# EAGLE design template1 (EAGLE 4.16)
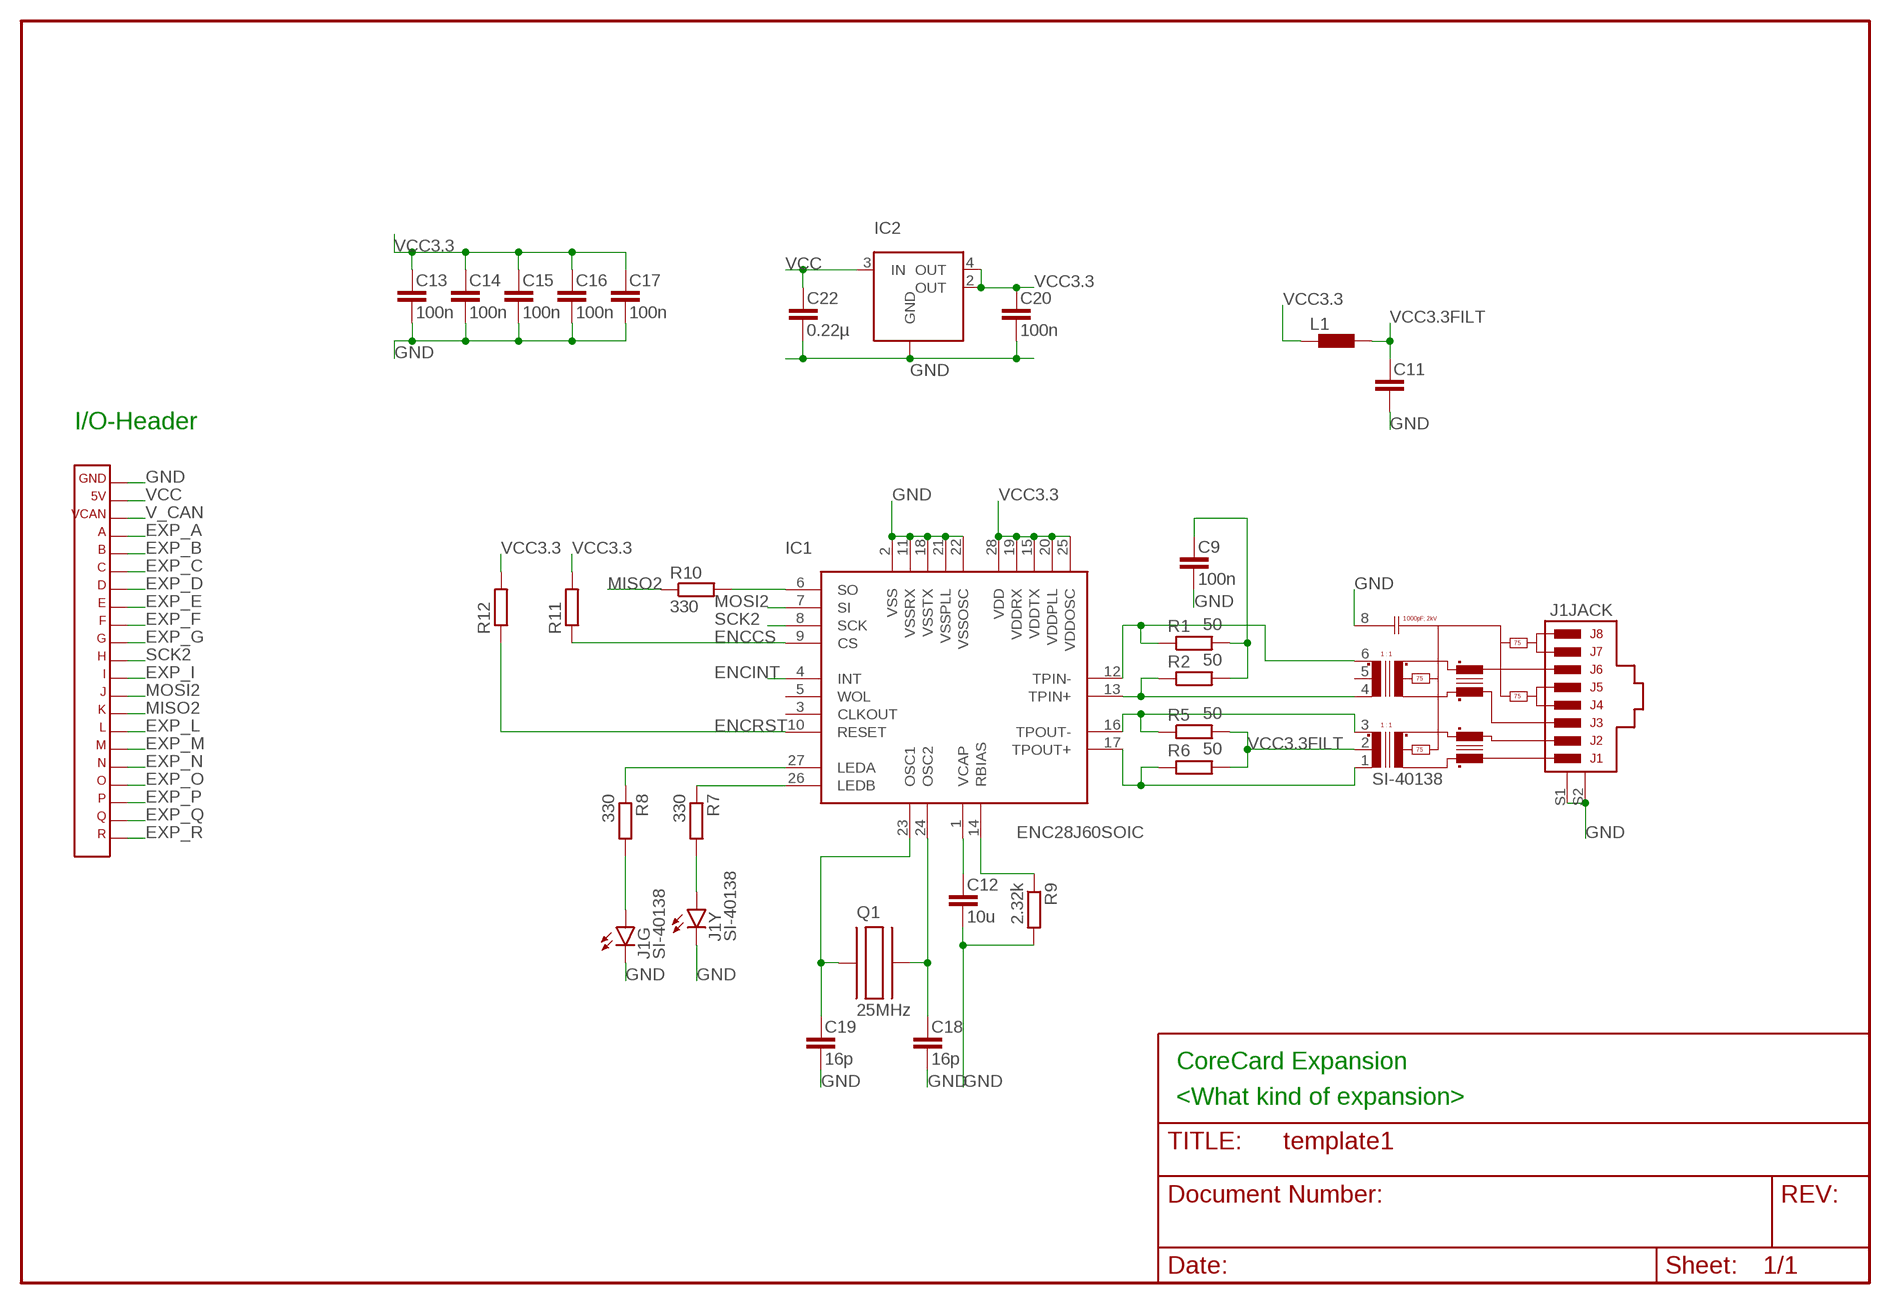
[diagram p0: schematic, sheet 1]

## Parts
C9  100n  C-EUC0603  [C0603]
C11  C-EUC0603  [C0603]
C12  10u  C-EUC0603  [C0603]
C13  100n  C-EUC0603  [C0603]
C14  100n  C-EUC0603  [C0603]
C15  100n  C-EUC0603  [C0603]
C16  100n  C-EUC0603  [C0603]
C17  100n  C-EUC0603  [C0603]
C18  16p  C-EUC0603  [C0603]
C19  16p  C-EUC0603  [C0603]
C20  100n  C-EUC0603  [C0603]
C22  0.22µ  C-EUC0603  [C0603]
IC1  ENC28J60SOIC  [SOIC-28]
IC2  LM1117MP-3.3  [SOT223]
J1  SI-40138  [SI-40138]
L1  L-EUL0603  [L0603]
Q1  25MHz  C-MAC-LFA147E  [SMD]
R1  50  R-EUR0603  [R0603]
R2  50  R-EUR0603  [R0603]
R5  50  R-EUR0603  [R0603]
R6  50  R-EUR0603  [R0603]
R7  330  R-EUR0603  [R0603]
R8  330  R-EUR0603  [R0603]
R9  2.32k  R-EUR0603  [R0603]
R10  330  R-EUR0603  [R0603]
R11  R-EUR0603  [R0603]
R12  R-EUR0603  [R0603]
X3  CORE_IOHEADEXP  [CORE_IOHEAD_NOSILC]

## Nets
ENCCS: IC1.9(CS) R11.1
ENCINT: IC1.4(INT)
ENCRST: IC1.10(RESET) R12.1
EXP_A: X3.4
EXP_B: X3.5
EXP_C: X3.6
EXP_D: X3.7
EXP_E: X3.8
EXP_F: X3.9
EXP_G: X3.10
EXP_I: X3.12
EXP_L: X3.15
EXP_M: X3.16
EXP_N: X3.17
EXP_O: X3.18
EXP_P: X3.19
EXP_Q: X3.20
EXP_R: X3.21
GND: C9.2 C11.2 C12.2 C13.2 C14.2 C15.2 C16.2 C18.2 C19.2 C20.2 C22.2 IC1.2(VSS) IC1.11(VSSRX) IC1.18(VSSTX) IC1.21(VSSPLL) IC1.22(VSSOSC) IC2.1(GND) J1.8(JACK:GND) J1.GC(G:C) J1.S1(JACK:S1) J1.S2(JACK:S2) J1.YC(Y:C) R9.2 X3.1
MISO2: R10.1 X3.14
MOSI2: IC1.7(SI) X3.13
N$1: C18.1 IC1.24(OSC2) Q1.P$2
N$2: C19.1 IC1.23(OSC1) Q1.P$1
N$3: IC1.6(SO) R10.2
N$4: C12.1 IC1.1(VCAP)
N$5: IC1.14(RBIAS) R9.1
N$6: IC1.27(LEDA) R8.1
N$7: IC1.26(LEDB) R7.1
N$9: J1.YA(Y:A) R7.2
N$10: J1.GA(G:A) R8.2
N$13: IC1.13(TPIN+) J1.4(JACK:TD-) R2.1
N$14: IC1.16(TPOUT-) J1.3(JACK:RD+) R5.1
N$16: IC1.17(TPOUT+) J1.1(JACK:RD-) R6.1
N$17: C9.1 R1.2 R2.2
N$18: IC1.12(TPIN-) J1.6(JACK:TD+) R1.1
SCK2: IC1.8(SCK) X3.11
V_CAN: X3.3
VCC: C22.1 IC2.3(IN) X3.2
VCC3.3: C13.1 C14.1 C15.1 C16.1 C17.1 C20.1 IC1.15(VDDTX) IC1.19(VDDRX) IC1.20(VDDPLL) IC1.25(VDDOSC) IC1.28(VDD) IC2.2(OUT) IC2.4(OUT) L1.1 R11.2 R12.2
VCC3.3FILT: C11.1 J1.2(JACK:CTR) L1.2 R5.2 R6.2
Unconnected: C17.2 IC1.3(CLKOUT) IC1.5(WOL) J1.5(JACK:CTT)

## Notes on the sheet
- I/O-Header
- CoreCard Expansion
- <What kind of expansion>

## Library data of the parts
C9 C11-C20 C22 = rcl:C-EU
IC1 = enc28j60:ENC28J60
IC2 = lm1117mp:LM1117MP-3.3
J1 = stewart_magjack:SI-40138
L1 = rcl:L-EU
Q1 = hc49-4h-smx:C-MAC-LFA147E
R1 R2 R5-R12 = rcl:R-EU
X3 = expboard:CORE_IOHEAD: CoreCard IO-header for expansion cards

## Board
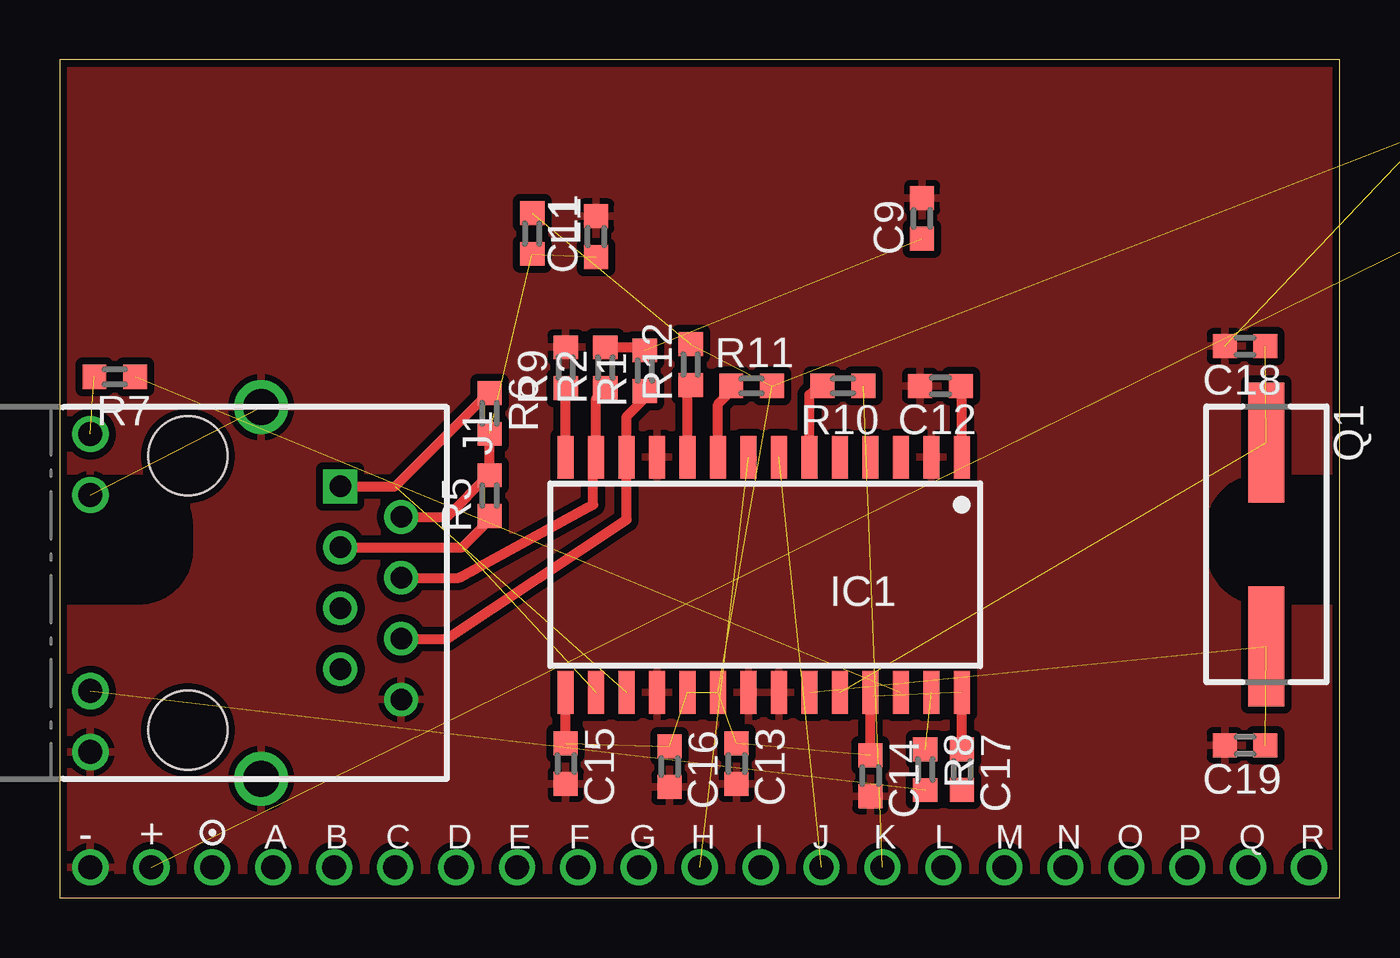
[diagram p1: board, top side]
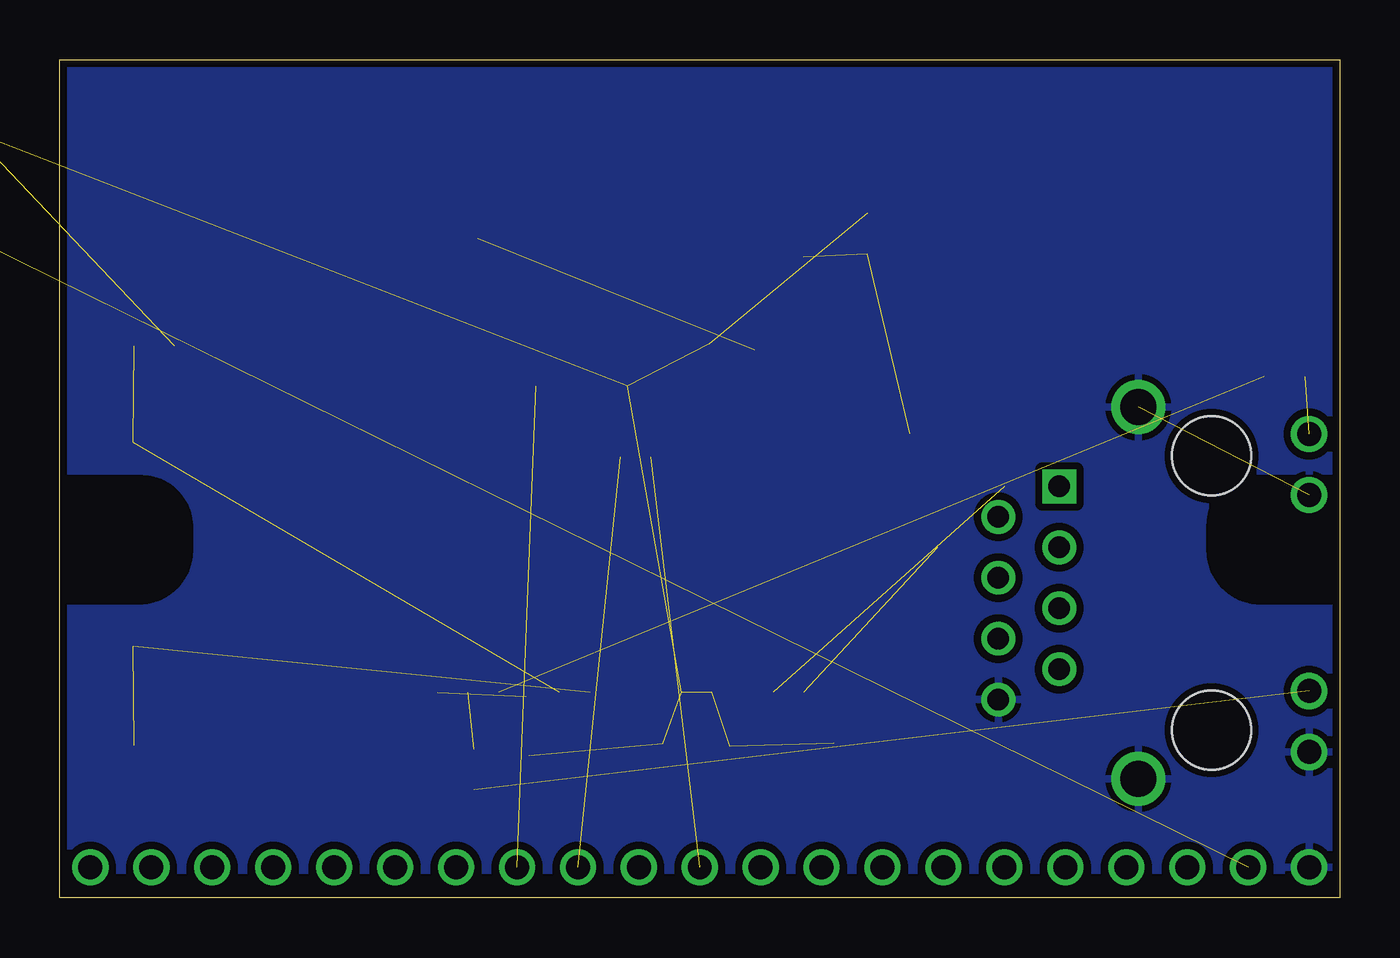
[diagram p2: board, bottom side, seen from below]

Size 53.34 x 34.92 mm. Coordinates in mm from the lower left corner, seen from the top.
Outline: 0,0 53.34,0 53.34,34.92 0,34.92 0,0
Copper layers (1*16): Top 0.035mm / dielectric 1.5mm / Bottom 0.035mm
Design rules "default": minimum track width 10mil, minimum drill 0.6mm, track to track 10mil, track to pad 10mil, pad to pad 10mil, via to via 10mil, smd to smd 8mil, copper to edge 10mil, drill to drill 8mil, minimum pad ring 10mil, minimum via ring 10mil, stop-mask expansion 4mil, vias tented up to drill 0mil, thermal gap 10mil
Holes 2.7 mm at 67.56,15.24 -6.99,21.59

### Footprints (pad centres in the part's own frame; a part is rotated, then mirrored left to right if it is on the bottom)
C0603 = smd 1 x 1: 1 -0.85,0; 2 0.85,0
SOIC-28 = smd 0.66 x 1.778: 1 -6.985,-4.902; 2 -5.715,-4.902; 3 -4.445,-4.902; 4 -3.175,-4.902; 5 -1.905,-4.902; 6 -0.635,-4.902; 7 0.635,-4.902; 8 1.905,-4.902; 9 3.175,-4.902; 10 4.445,-4.902; 11 5.715,-4.902; 12 6.985,-4.902; 13 8.255,-4.902; 14 9.525,-4.902; 15 9.525,4.902; 16 8.255,4.902; 17 6.985,4.902; 18 5.715,4.902; 19 4.445,4.902; 20 3.175,4.902; 21 1.905,4.902; 22 0.635,4.902; 23 -0.635,4.902; 24 -1.905,4.902; 25 -3.175,4.902; 26 -4.445,4.902; 27 -5.715,4.902; 28 -6.985,4.902
SOT223 = smd 1.219 x 2.235: 1 -2.311,-3.099; 2 0,-3.099; 3 2.311,-3.099 | smd 3.6 x 2.2: 4 0,3.099
SI-40138 = drill 0.9 square: 1 -4.445,6.35 | drill 0.9 round: 2 -3.175,8.89; 3 -1.905,6.35; 4 -0.635,8.89; 5 0.635,6.35; 6 1.905,8.89; 7 3.175,6.35; 8 4.445,8.89 | drill 1 round: GA 4.089,-4.064; GC 6.629,-4.064; YA -6.629,-4.064; YC -4.089,-4.064 | drill 1.5 round: S1 -7.747,3.048; S2 7.747,3.048 | hole 3.3: -5.715,0; 5.715,0
L0603 = smd 0.991 x 1.016: 1 -0.85,0; 2 0.85,0
SMD = smd 5 x 1.5: P$1 4.25,0; P$2 -4.25,0
R0603 = smd 0.991 x 1.016: 1 -0.85,0; 2 0.85,0
CORE_IOHEAD_NOSILC = drill 1 round: 1 25.4,0; 2 22.86,0; 3 20.32,0; 4 17.78,0; 5 15.24,0; 6 12.7,0; 7 10.16,0; 8 7.62,0; 9 5.08,0; 10 2.54,0; 11 0,0; 12 -2.54,0; 13 -5.08,0; 14 -7.62,0; 15 -10.16,0; 16 -12.7,0; 17 -15.24,0; 18 -17.78,0; 19 -20.32,0; 20 -22.86,0; 21 -25.4,0

### Placement (x,y rotation side)
C9  35.94,28.32 90 top
C11  22.35,27.56 90 top
C12  36.7,21.34 180 top
C13  28.19,5.59 270 top
C14  33.78,5.08 270 top
C15  21.08,5.59 270 top
C16  25.4,5.46 270 top
C17  37.59,5.33 270 top
C18  49.4,22.99 180 top
C19  49.4,6.35 180 top
C20  58.93,33.02 180 top  (outside the outline)
C22  60.58,28.83 0 top  (outside the outline)
IC1  30.61,13.46 180 top
IC2  67.31,30.1 0 top  (outside the outline)
J1  5.33,12.7 270 top
L1  19.68,27.69 270 top
Q1  50.29,14.73 270 top
R1  24.38,21.97 90 top
R2  22.73,22.1 90 top
R5  17.91,16.76 90 top
R6  17.91,20.19 270 top
R7  2.29,21.72 180 top
R8  36.07,5.33 270 top
R9  21.08,22.1 90 top
R10  32.64,21.34 180 top
R11  28.83,21.34 0 top
R12  26.29,22.23 90 top
X3  26.67,1.27 0 bottom

### Tracks (layer width: path | path; a pad name or v marks a point on that pad's centre or on a via)
ENCCS
  Top 0.406: R11.1 27.98,21.12 27.43,20.57 IC1.9
ENCRST
  Top 0.406: R12.1 26.29,21.34 26.42,21.21 26.16,20.95 IC1.10
GND  (4 unrouted)
  pour Bottom (isolate 0.305, rank 3): 0,34.92 53.34,34.92 53.34,17.78 50.04,17.78 arc90 47.62,15.49 47.62,14.48 arc90 50.04,12.06 53.34,12.06 53.34,1.14 0,1.14 0,12.06 3.3,12.06 arc90 5.71,14.48 5.71,15.49 arc90 3.43,17.78 0,17.78
  pour Top (isolate 0.305, rank 3): 0,34.92 53.34,34.92 53.34,17.78 50.04,17.78 arc90 47.62,15.49 47.62,14.48 arc90 50.04,12.06 53.34,12.06 53.34,1.14 0,1.14 0,12.06 3.3,12.06 arc90 5.71,14.48 5.71,15.49 arc90 3.43,17.78 0,17.78
MISO2  (1 unrouted)
MOSI2  (1 unrouted)
N$1  (2 unrouted)
N$2  (2 unrouted)
N$3
  Top 0.406: R10.2 31.62,21.34 31.24,20.95 IC1.6
N$4
  Top 0.406: C12.1 37.55,21.12 37.59,21.08 IC1.1
N$5
  Top 0.406: R9.1 21.12,21.25 21.08,21.21 IC1.14
N$6  (1 unrouted)
N$7  (1 unrouted)
N$9  (1 unrouted)
N$10  (1 unrouted)
N$13
  Top 0.406: J1.4 16.64,13.34 22.23,16.38 22.23,18.03 22.48,18.29 22.4,18.36 IC1.13 22.35,20.83 22.73,21.21 R2.1
N$14  (1 unrouted)
  Top 0.406: R5.1 17.91,15.75 16.76,14.61 J1.3
N$16  (1 unrouted)
  Top 0.406: R6.1 17.91,21.08 13.97,17.14 J1.1
N$17  (1 unrouted)
  Top 0.406: R1.2 24.38,22.73 24.17,22.95 R2.2
N$18
  Top 0.406: J1.6 16.13,10.79 23.62,15.75 23.62,18.16 23.75,18.29 23.67,18.36 IC1.12 23.62,20.07 24.51,20.95 24.38,21.08 R1.1
SCK2  (1 unrouted)
VCC  (2 unrouted)
VCC3.3  (12 unrouted)
  Top 0.406: IC1.15 21.01,8.56 20.95,8.51 21.08,8.38 C15.1 | IC1.25 33.78,8.51 33.91,8.38 33.78,8.26 C14.1 | 37.63,6.18 37.72,6.1 | C17.1 37.63,6.18 | IC1.28 37.59,6.22 37.63,6.18
VCC3.3FILT  (2 unrouted)
  Top 0.406: J1.2 16.13,15.88 17.91,17.65 R5.2 18.07,17.61 | 18.07,17.61 18.16,17.53 | R6.2 17.91,17.78 18.07,17.61

### Text on the board
tPlace: - | + | A | B | C | D | E | F | G | H | I | J | K | L | M | N | O | P | Q | R
Document: Top is component side | Expansion will be mounted bottom to bottom with CoreCard | Change vertical dimension to fit | Remove I/O-header silcscreen if neccesary | Remove mounting holes if neccesary